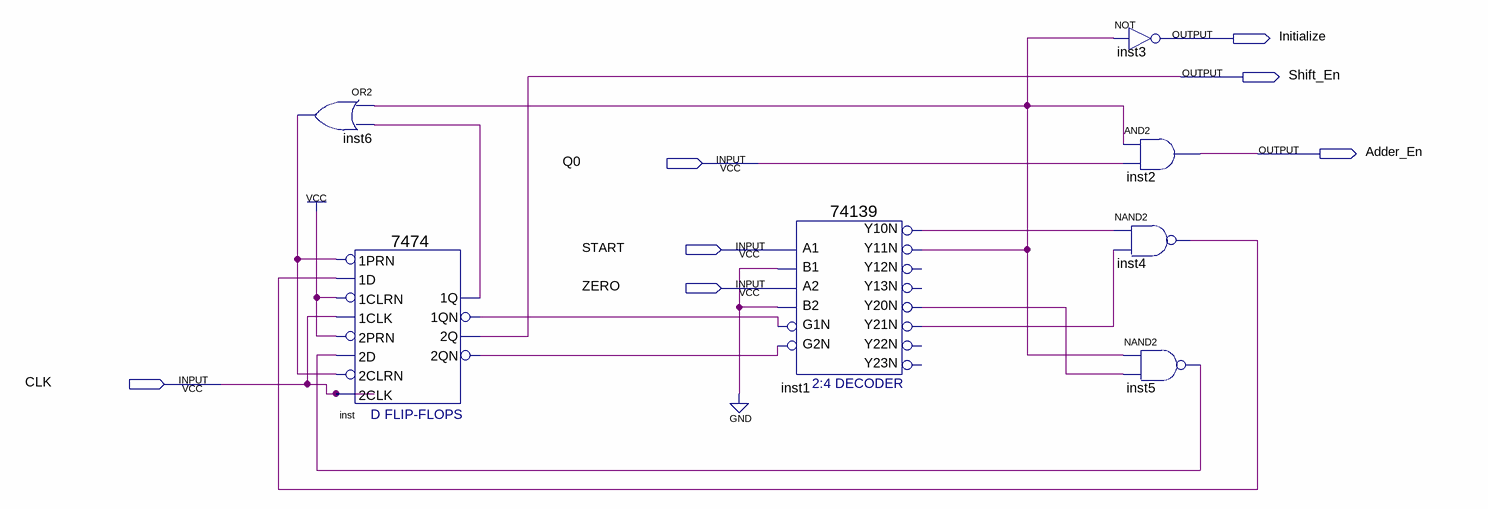
[diagram p0: schematic sheet]
// Quartus schematic control(1).bdf as structural Verilog: 7 symbols, 7 pins
module \control(1)  (
  input  Q0,
  input  START,
  input  ZERO,
  input  CLK,
  output Initialize,
  output Shift_En,
  output Adder_En
);

  wire inst1_y10n, inst1_y11n, inst1_y20n, inst1_y21n, inst4_out, inst5_out, inst6_out, inst_1q, inst_1qn,
       inst_2qn;

  or inst6 (inst6_out, inst1_y11n, inst_1q);
  \7474  inst (
    .\2D (inst5_out), .\2PRN (1'b1), .\1CLK (CLK), .\1D (inst4_out), .\1PRN (inst6_out), .\2CLK (CLK),
    .\2CLRN (inst6_out), .\1CLRN (1'b1), .\1QN (inst_1qn), .\2Q (Shift_En), .\2QN (inst_2qn), .\1Q (inst_1q));
  \74139  inst1 (
    .A1(START), .A2(ZERO), .B1(1'b0), .B2(1'b0), .G1N(inst_1qn), .G2N(inst_2qn), .Y10N(inst1_y10n),
    .Y20N(inst1_y20n), .Y11N(inst1_y11n), .Y21N(inst1_y21n));  // open: Y13N, Y12N, Y22N, Y23N
  not inst3 (Initialize, inst1_y11n);
  and inst2 (Adder_En, inst1_y11n, Q0);
  nand inst4 (inst4_out, inst1_y10n, inst1_y21n);
  nand inst5 (inst5_out, inst1_y11n, inst1_y20n);
endmodule
